# Altium schematic sheet I2Cexpander.SchDoc
size A; SheetNumber: 5; SheetTotal: 10
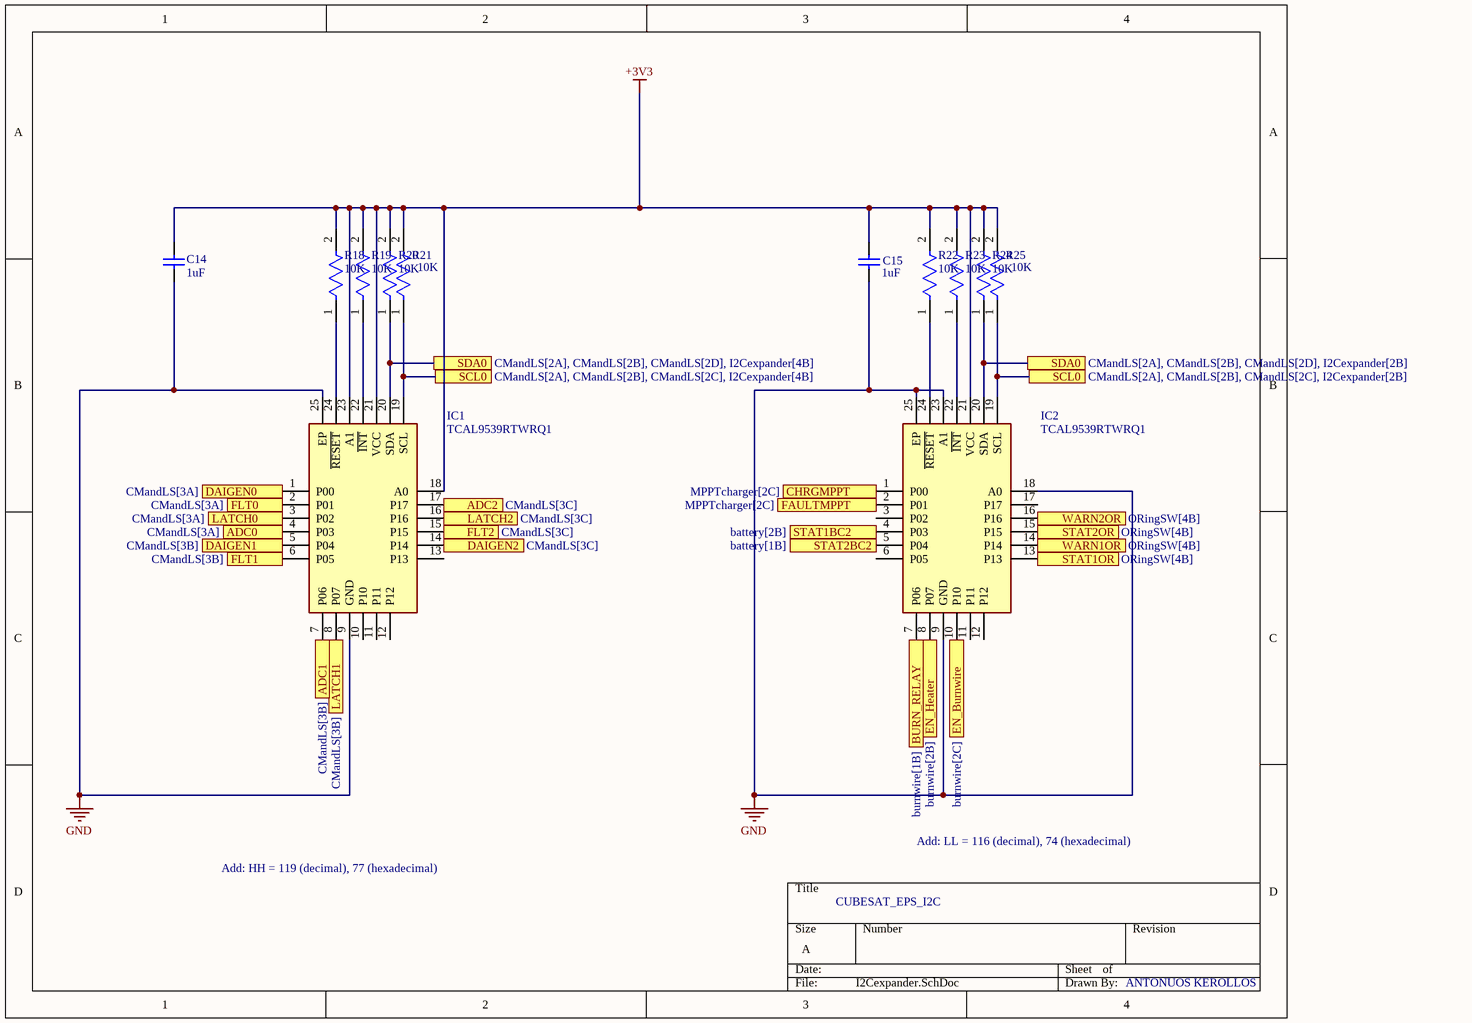
[diagram p0: I2Cexpander.SchDoc]

## Parts
C14  1uF  [CAPC2013X140X50LL20T25]
C15  1uF  [CAPC2013X140X50LL20T25]
IC1  TCAL9539RTWRQ1  [QFN50P400X400X80-25N-D]
IC2  TCAL9539RTWRQ1  [QFN50P400X400X80-25N-D]
R18  10K  [FP-CRCW0805-e3-IPC_A]
R19  10K  [FP-CRCW0805-e3-IPC_A]
R20  10K  [FP-CRCW0805-e3-IPC_A]
R21  10K  [FP-CRCW0805-e3-IPC_A]
R22  10K  [FP-CRCW0805-e3-IPC_A]
R23  10K  [FP-CRCW0805-e3-IPC_A]
R24  10K  [FP-CRCW0805-e3-IPC_A]
R25  10K  [FP-CRCW0805-e3-IPC_A]

## Ports
ADC0 (see CMandLS[3A]), ADC1 (see CMandLS[3B]), ADC2 (see CMandLS[3C]), BURN_RELAY (see burnwire[1B]), CHRGMPPT (see MPPTcharger[2C]), DAIGEN0 (see CMandLS[3A]), DAIGEN1 (see CMandLS[3B]), DAIGEN2 (see CMandLS[3C]), EN_Burnwire (see burnwire[2C]), EN_Heater (see burnwire[2B]), FAULTMPPT (see MPPTcharger[2C]), FLT0 (see CMandLS[3A]), FLT1 (see CMandLS[3B]), FLT2 (see CMandLS[3C]), LATCH0 (see CMandLS[3A]), LATCH1 (see CMandLS[3B]), LATCH2 (see CMandLS[3C]), SCL0 (see CMandLS[2A], CMandLS[2B], CMandLS[2C], I2Cexpander[2B]), SCL0 (see CMandLS[2A], CMandLS[2B], CMandLS[2C], I2Cexpander[4B]), SDA0 (see CMandLS[2A], CMandLS[2B], CMandLS[2D], I2Cexpander[2B]), SDA0 (see CMandLS[2A], CMandLS[2B], CMandLS[2D], I2Cexpander[4B]), STAT1BC2 (see battery[2B]), STAT1OR (see ORingSW[4B]), STAT2BC2 (see battery[1B]), STAT2OR (see ORingSW[4B]), WARN1OR (see ORingSW[4B]), WARN2OR (see ORingSW[4B])

## Nets
+3V3: C14.2 C15.2 IC1.18(A0) IC1.21(VCC) IC1.23(A1) IC2.21(VCC) R18.2 R19.2 R20.2 R21.2 R22.2 R23.2 R24.2 R25.2
GND: C14.1 C15.1 IC1.9(GND) IC1.25(EP) IC2.9(GND) IC2.18(A0) IC2.23(A1) IC2.25(EP)
ADC0: IC1.4(P03) ; port ADC0
ADC1: IC1.7(P06) ; port ADC1
ADC2: IC1.17(P17) ; port ADC2
BURN_RELAY: IC2.7(P06) ; port BURN_RELAY
CHRGMPPT: IC2.1(P00) ; port CHRGMPPT
DAIGEN0: IC1.1(P00) ; port DAIGEN0
DAIGEN1: IC1.5(P04) ; port DAIGEN1
DAIGEN2: IC1.14(P14) ; port DAIGEN2
EN_Burnwire: IC2.10(P10) ; port EN_Burnwire
EN_Heater: IC2.8(P07) ; port EN_Heater
FAULTMPPT: IC2.2(P01) ; port FAULTMPPT
FLT0: IC1.2(P01) ; port FLT0
FLT1: IC1.6(P05) ; port FLT1
FLT2: IC1.15(P15) ; port FLT2
LATCH0: IC1.3(P02) ; port LATCH0
LATCH1: IC1.8(P07) ; port LATCH1
LATCH2: IC1.16(P16) ; port LATCH2
SCL0: IC1.19(SCL) IC2.19(SCL) R21.1 R25.1 ; port SCL0
SDA0: IC1.20(SDA) IC2.20(SDA) R20.1 R24.1 ; port SDA0
STAT1BC2: IC2.4(P03) ; port STAT1BC2
STAT1OR: IC2.13(P13) ; port STAT1OR
STAT2BC2: IC2.5(P04) ; port STAT2BC2
STAT2OR: IC2.15(P15) ; port STAT2OR
WARN1OR: IC2.14(P14) ; port WARN1OR
WARN2OR: IC2.16(P16) ; port WARN2OR
NetIC1_22: IC1.22(~{INT}) R19.1
NetIC1_24: IC1.24(~{RESET}) R18.1
NetIC2_22: IC2.22(~{INT}) R23.1
NetIC2_24: IC2.24(~{RESET}) R22.1

Not connected (* = marked no-connect by the designer): IC1 10(P10) 11(P11) 12(P12) 13(P13); IC2 3(P02) 6(P05) 11(P11) 12(P12) 17(P17)

## Notes on the sheet
- Add: HH = 119 (decimal), 77 (hexadecimal)
- CUBESAT_EPS_I2C
- Add: LL = 116 (decimal), 74 (hexadecimal)
- ANTONUOS KEROLLOS

## Library data of the parts
C14 C15 = CMP-2007-03234-1: Part Number: C0805C105K3RACTU; Manufacturer: Kemet
IC1 IC2 = TCAL9539RTWRQ1: Integrated Circuit; Manufacturer_Name: Texas Instruments; Datasheet Link: https://www.ti.com/lit/ds/symlink/tcal9539-q1.pdf?HQS=dis-mous-null-mousermode-dsf-pf-null-wwe&ts=1700652795434&ref_url=https%253A%252F%252Fwww.mouser.co.il%252F; Height: 0.8mm; Manufacturer_Part_Number: TCAL9539RTWRQ1; Mouser Part Number: 595-TCAL9539RTWRQ1; Mouser Price/Stock: https://www.mouser.co.uk/ProductDetail/Texas-Instruments/TCAL9539RTWRQ1?qs=HoCaDK9Nz5cqBCs4xXWfwA%3D%3D; Arrow Part Number: TCAL9539RTWRQ1; Arrow Price/Stock: null?region=nac
R18-R25 = CMP-2001-04908-2: RES Thick Film, 10kΩ, 1%, 0.125W, 100ppm/°C, 0805; Resistance: 10kR; Voltage Rating (DC): 150V; Power Rating: 125mW; Weight: 0.000194oz; Package Quantity: 5000; Military Standard: Not; Max Operating Temperature: 155°C; Temperature Coefficient: 100ppm/°C; Contact Plating: Tin; Width: 1.25mm; Height: 0.45mm; Radiation Hardening: No; Tolerance: 1%; Min Operating Temperature: -55°C; Voltage Rating: 150V; Length: 2mm; Depth: 1.25mm; Termination: SMD/SMT; Packaging: Tape and Reel; Case/Package: 0805; Case Code (Metric): 2012; Lead Free: Lead Free; Case Code (Imperial): 0805; Composition: Thick Film